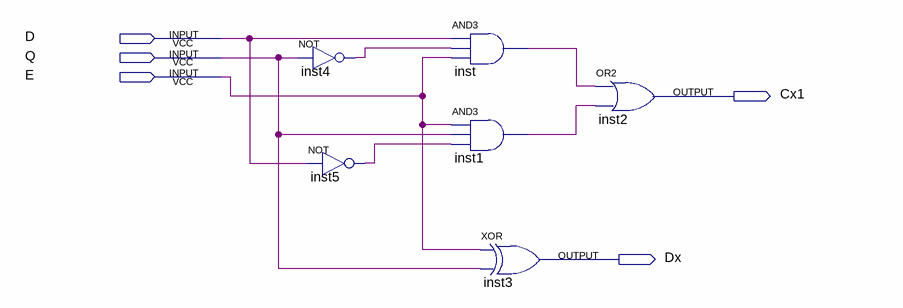
[diagram p0: schematic sheet]
// Quartus schematic HAS.bdf as structural Verilog: 6 symbols, 5 pins
module HAS (
  input  D,
  input  Q,
  input  E,
  output Cx1,
  output Dx
);

  wire inst1_out, inst4_out, inst5_out, inst_out;

  not inst4 (inst4_out, Q);
  not inst5 (inst5_out, D);
  and inst (inst_out, D, inst4_out, E);
  and inst1 (inst1_out, E, Q, inst5_out);
  xor inst3 (Dx, E, Q);
  or inst2 (Cx1, inst_out, inst1_out);
endmodule
